# Altium project ElectroSketch.PrjPcb
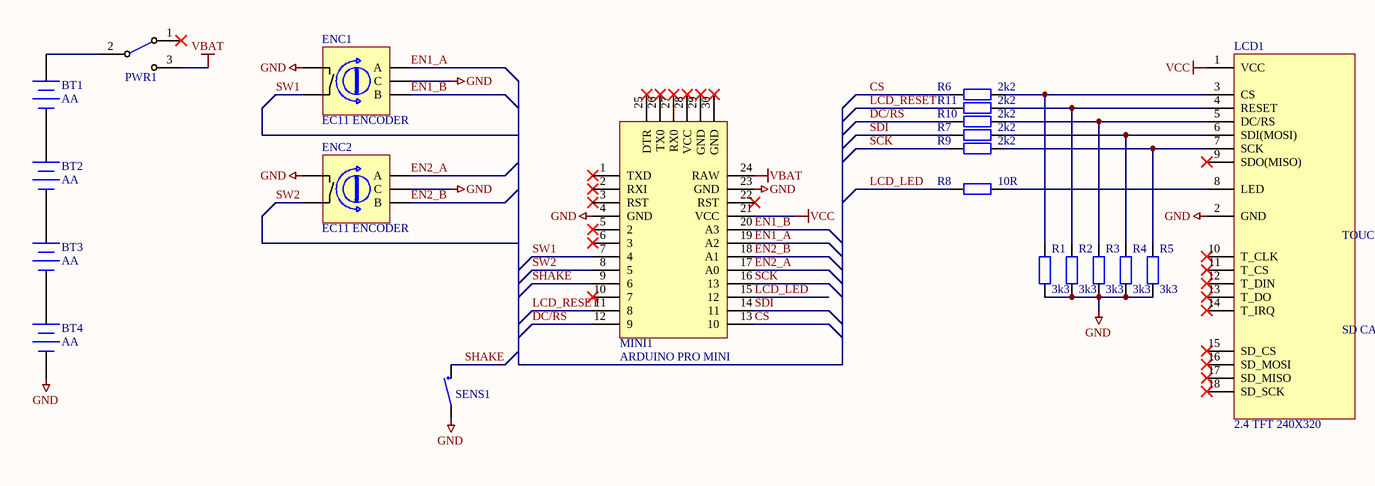
[diagram p0: ElectroSketch.SchDoc]
1 sheet, 21 parts. Net scope: global (net labels, ports and power ports of the same name join across sheets).
Board file: ElectroSketch_01.PcbDoc

## Sheet ElectroSketch.SchDoc: 907 Controller
size A4; Date: FIXED DATE; ApprovedBy: ABB; CheckedBy: CHECKED; Author: AUTHOR; CompanyName: COMPANY; DrawnBy: DRAWN BY; Engineer: ENGInEER; Organization: ORGANIZATION; Address1: add1; Address2: add2; Address3: add3; Address4: add4; DocumentNumber: LCL_0xx; Revision: 0; SheetNumber: 1; SheetTotal: 1; CurrentTime: TIME; CurrentDate: DATE; Time: TIME; DocumentFullPathAndName: FULL PATH NAME; DocumentName: DOC NAME; ModifiedDate: MODOFIED; ProjectName: PROJECT; Application_BuildNumber: AB

### Parts
BT1  AA  [AA HOLDER]
BT2  AA  [AA HOLDER]
BT3  AA  [AA HOLDER]
BT4  AA  [AA HOLDER]
ENC1  EC11 ENCODER  [EC11 ENCODER]
ENC2  EC11 ENCODER  [EC11 ENCODER]
LCD1  2.4 TFT 240X320  [2.4" TFT LCD]
MINI1  ARDUINO PRO MINI  [ARDUINO PRO MINI]
PWR1  SS12D00G3  [SS12D00G3]  (value not drawn)
R1  3k3  [RESISTOR 0.400"]
R2  3k3  [RESISTOR 0.400"]
R3  3k3  [RESISTOR 0.400"]
R4  3k3  [RESISTOR 0.400"]
R5  3k3  [RESISTOR 0.400"]
R6  2k2  [RESISTOR 0.400"]
R7  2k2  [RESISTOR 0.400"]
R8  10R  [RESISTOR 0.400"]
R9  2k2  [RESISTOR 0.400"]
R10  2k2  [RESISTOR 0.400"]
R11  2k2  [RESISTOR 0.400"]
SENS1  SHAKE SENSOR  [SHAKE SENSOR]  (value not drawn)

### Nets
GND: BT4.2(-) ENC1.2(C) ENC1.4(SW_0) ENC2.2(C) ENC2.4(SW_0) LCD1.2(GND) MINI1.4(GND) MINI1.23(GND) R1.1 R2.1 R3.1 R4.1 R5.1 SENS1.1
VBAT: MINI1.24(RAW) PWR1.3
VCC: LCD1.1(VCC) MINI1.21(VCC)
CS: MINI1.13(10) R6.1
DC/RS: MINI1.12(9) R10.1
EN1_A: ENC1.1(A) MINI1.19(A2)
EN1_B: ENC1.3(B) MINI1.20(A3)
EN2_A: ENC2.1(A) MINI1.17(A0)
EN2_B: ENC2.3(B) MINI1.18(A1)
LCD_LED: MINI1.15(12) R8.2
LCD_RESET: MINI1.11(8) R11.1
SCK: MINI1.16(13) R9.1
SDI: MINI1.14(11) R7.1
SHAKE: MINI1.9(6) SENS1.2
SW1: ENC1.5(SW_1) MINI1.7(4)
SW2: ENC2.5(SW_1) MINI1.8(5)
NetBT1_1: BT1.1(+) PWR1.2
NetBT1_2: BT1.2(-) BT2.1(+)
NetBT2_2: BT2.2(-) BT3.1(+)
NetBT3_2: BT3.2(-) BT4.1(+)
NetLCD1_3: LCD1.3(CS) R1.2 R6.2
NetLCD1_4: LCD1.4(RESET) R2.2 R11.2
NetLCD1_5: LCD1.5(DC/RS) R3.2 R10.2
NetLCD1_6: LCD1.6(SDI(MOSI)) R4.2 R7.2
NetLCD1_7: LCD1.7(SCK) R5.2 R9.2
NetLCD1_8: LCD1.8(LED) R8.1

Not connected (* = marked no-connect by the designer): LCD1 9(SDO(MISO))* 10(T_CLK)* 11(T_CS)* 12(T_DIN)* 13(T_DO)* 14(T_IRQ)* 15(SD_CS)* 16(SD_MOSI)* 17(SD_MISO)* 18(SD_SCK)*; MINI1 1(TXD)* 2(RXI)* 3(RST)* 5(2)* 6(3)* 10(7)* 22(RST)* 25(DTR)* 26(TX0)* 27(RX0)* 28(VCC)* 29(GND)* 30(GND)*; PWR1 1*

### Notes on the sheet
- LOW COST LABS
- Title
- Size:
- Date:
- A4
- Number:
- Revision:
- Sheet
- of
- File:
- (in symbol 2.4 TFT 240X320) TOUCH SCREEN; SD CARD

### Library data of the parts
BT1-BT4 = Battery: Multicell Battery; Published: 24-Mar-1999; LatestRevisionDate: 17-Jul-2002; LatestRevisionNote: Re-released for DXP Platform.; PackageReference: BAT-2; Publisher: Altium Limited; PackageDescription: Battery; 2 Leads
ENC1 ENC2 = EC11 ENCODER: EC11 ROTARY ENCODER WITH PUSH BUTTON
PWR1 = SS12D00G3 Toggle Switch
R1-R11 = CMP-iaxfckaaxq3jb0c9euu5-1: RESISITOR THROUGH HOLE 1/4W; CustomComponentID: iaxfckaaxq3jb0c9euu5
SENS1 = SHAKE SENSOR: Published: 8-Jun-2000; LatestRevisionDate: 17-Jul-2002; LatestRevisionNote: Re-released for DXP Platform.; PackageReference: AXIAL-0.4; Publisher: Altium Limited; PackageDescription: Axial Device, Thru-Hole; 2 Leads; 0.4 in Pin Spacing